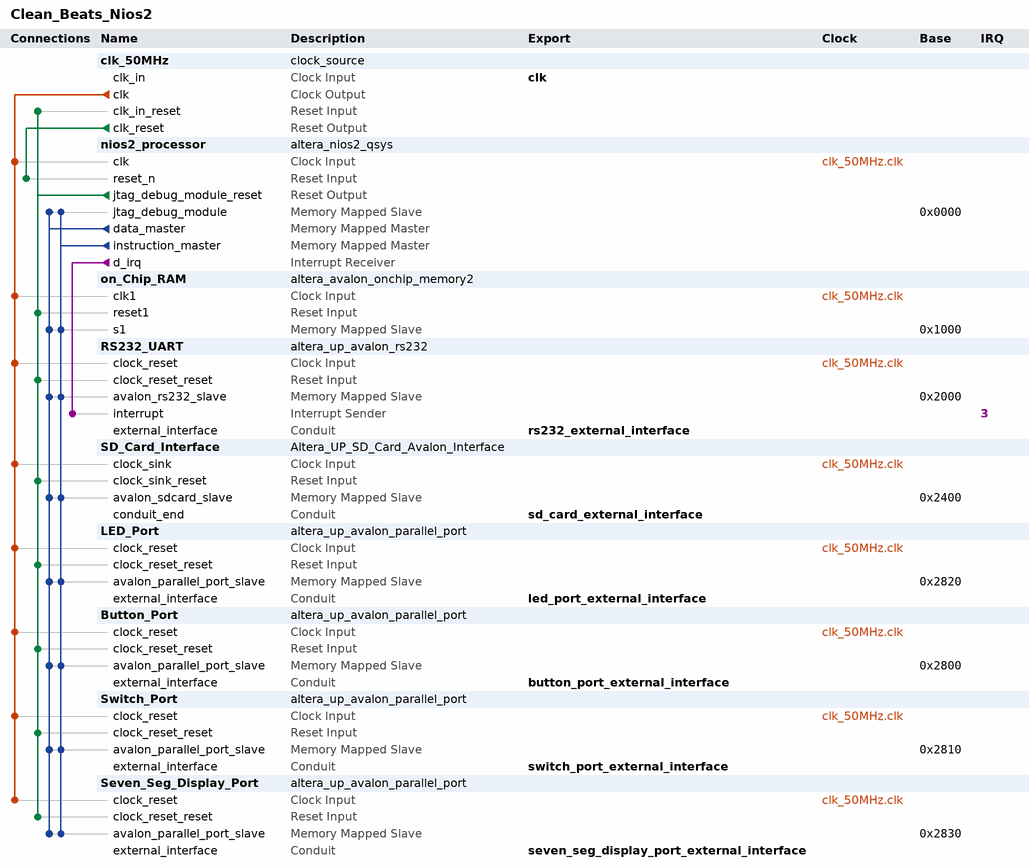
[diagram p0: system contents]
# Platform Designer (Qsys) system Clean_Beats_Nios2, Cyclone III EP3C16F484C6
# Parameters at their usual value, and those the tool derives, are not listed.
package require -exact qsys 12.0
create_system Clean_Beats_Nios2
set_project_property DEVICE_FAMILY {Cyclone III}
set_project_property DEVICE EP3C16F484C6

add_instance clk_50MHz clock_source 12.1
set_instance_parameter_value clk_50MHz clockFrequency 50000000

add_instance nios2_processor altera_nios2_qsys 12.1
set_instance_parameter_value nios2_processor setting_preciseIllegalMemAccessException true
set_instance_parameter_value nios2_processor setting_illegalInstructionsTrap true
set_instance_parameter_value nios2_processor mmu_TLBMissExcOffset 64
set_instance_parameter_value nios2_processor resetSlave on_Chip_RAM.s1
set_instance_parameter_value nios2_processor mmu_TLBMissExcSlave on_Chip_ROM.s1
set_instance_parameter_value nios2_processor exceptionSlave on_Chip_RAM.s1
set_instance_parameter_value nios2_processor breakSlave nios2_processor.jtag_debug_module
set_instance_parameter_value nios2_processor impl Fast
set_instance_parameter_value nios2_processor icache_size 4096

add_instance on_Chip_RAM altera_avalon_onchip_memory2 12.1
set_instance_parameter_value on_Chip_RAM dataWidth 32
set_instance_parameter_value on_Chip_RAM dualPort false
set_instance_parameter_value on_Chip_RAM initMemContent true
set_instance_parameter_value on_Chip_RAM initializationFileName on_Chip_RAM
set_instance_parameter_value on_Chip_RAM memorySize 4096

add_instance RS232_UART altera_up_avalon_rs232 12.0
set_instance_parameter_value RS232_UART baud 9600
set_instance_parameter_value RS232_UART parity None

add_instance SD_Card_Interface Altera_UP_SD_Card_Avalon_Interface 1.0

add_instance LED_Port altera_up_avalon_parallel_port 12.0
set_instance_parameter_value LED_Port board DE0
set_instance_parameter_value LED_Port preset LEDs
set_instance_parameter_value LED_Port capture false
set_instance_parameter_value LED_Port edge Rising
set_instance_parameter_value LED_Port irq false

add_instance Button_Port altera_up_avalon_parallel_port 12.0
set_instance_parameter_value Button_Port board DE0
set_instance_parameter_value Button_Port preset Pushbuttons
set_instance_parameter_value Button_Port capture false
set_instance_parameter_value Button_Port edge Rising
set_instance_parameter_value Button_Port irq false

add_instance Switch_Port altera_up_avalon_parallel_port 12.0
set_instance_parameter_value Switch_Port board DE0
set_instance_parameter_value Switch_Port preset {Slider Switches}
set_instance_parameter_value Switch_Port capture false
set_instance_parameter_value Switch_Port edge Rising
set_instance_parameter_value Switch_Port irq false

add_instance Seven_Seg_Display_Port altera_up_avalon_parallel_port 12.0
set_instance_parameter_value Seven_Seg_Display_Port board DE0
set_instance_parameter_value Seven_Seg_Display_Port preset {Seven Segment Displays}
set_instance_parameter_value Seven_Seg_Display_Port capture false
set_instance_parameter_value Seven_Seg_Display_Port edge Rising
set_instance_parameter_value Seven_Seg_Display_Port irq false

# connections
add_connection clk_50MHz.clk Button_Port.clock_reset clock
add_connection clk_50MHz.clk LED_Port.clock_reset clock
add_connection clk_50MHz.clk nios2_processor.clk clock
add_connection clk_50MHz.clk on_Chip_RAM.clk1 clock
add_connection clk_50MHz.clk RS232_UART.clock_reset clock
add_connection clk_50MHz.clk SD_Card_Interface.clock_sink clock
add_connection clk_50MHz.clk Seven_Seg_Display_Port.clock_reset clock
add_connection clk_50MHz.clk Switch_Port.clock_reset clock
add_connection clk_50MHz.clk_reset nios2_processor.reset_n reset
add_connection nios2_processor.jtag_debug_module_reset Button_Port.clock_reset_reset reset
add_connection nios2_processor.jtag_debug_module_reset clk_50MHz.clk_in_reset reset
add_connection nios2_processor.jtag_debug_module_reset LED_Port.clock_reset_reset reset
add_connection nios2_processor.jtag_debug_module_reset on_Chip_RAM.reset1 reset
add_connection nios2_processor.jtag_debug_module_reset RS232_UART.clock_reset_reset reset
add_connection nios2_processor.jtag_debug_module_reset SD_Card_Interface.clock_sink_reset reset
add_connection nios2_processor.jtag_debug_module_reset Seven_Seg_Display_Port.clock_reset_reset reset
add_connection nios2_processor.jtag_debug_module_reset Switch_Port.clock_reset_reset reset
add_connection nios2_processor.data_master Button_Port.avalon_parallel_port_slave avalon
set_connection_parameter_value nios2_processor.data_master/Button_Port.avalon_parallel_port_slave baseAddress 0x2800
add_connection nios2_processor.data_master LED_Port.avalon_parallel_port_slave avalon
set_connection_parameter_value nios2_processor.data_master/LED_Port.avalon_parallel_port_slave baseAddress 0x2820
add_connection nios2_processor.data_master nios2_processor.jtag_debug_module avalon
set_connection_parameter_value nios2_processor.data_master/nios2_processor.jtag_debug_module baseAddress 0x0000
add_connection nios2_processor.data_master on_Chip_RAM.s1 avalon
set_connection_parameter_value nios2_processor.data_master/on_Chip_RAM.s1 baseAddress 0x1000
add_connection nios2_processor.data_master RS232_UART.avalon_rs232_slave avalon
set_connection_parameter_value nios2_processor.data_master/RS232_UART.avalon_rs232_slave baseAddress 0x2000
add_connection nios2_processor.data_master SD_Card_Interface.avalon_sdcard_slave avalon
set_connection_parameter_value nios2_processor.data_master/SD_Card_Interface.avalon_sdcard_slave baseAddress 0x2400
add_connection nios2_processor.data_master Seven_Seg_Display_Port.avalon_parallel_port_slave avalon
set_connection_parameter_value nios2_processor.data_master/Seven_Seg_Display_Port.avalon_parallel_port_slave baseAddress 0x2830
add_connection nios2_processor.data_master Switch_Port.avalon_parallel_port_slave avalon
set_connection_parameter_value nios2_processor.data_master/Switch_Port.avalon_parallel_port_slave baseAddress 0x2810
add_connection nios2_processor.instruction_master Button_Port.avalon_parallel_port_slave avalon
set_connection_parameter_value nios2_processor.instruction_master/Button_Port.avalon_parallel_port_slave baseAddress 0x2800
add_connection nios2_processor.instruction_master LED_Port.avalon_parallel_port_slave avalon
set_connection_parameter_value nios2_processor.instruction_master/LED_Port.avalon_parallel_port_slave baseAddress 0x2820
add_connection nios2_processor.instruction_master nios2_processor.jtag_debug_module avalon
set_connection_parameter_value nios2_processor.instruction_master/nios2_processor.jtag_debug_module baseAddress 0x0000
add_connection nios2_processor.instruction_master on_Chip_RAM.s1 avalon
set_connection_parameter_value nios2_processor.instruction_master/on_Chip_RAM.s1 baseAddress 0x1000
add_connection nios2_processor.instruction_master RS232_UART.avalon_rs232_slave avalon
set_connection_parameter_value nios2_processor.instruction_master/RS232_UART.avalon_rs232_slave baseAddress 0x2000
add_connection nios2_processor.instruction_master SD_Card_Interface.avalon_sdcard_slave avalon
set_connection_parameter_value nios2_processor.instruction_master/SD_Card_Interface.avalon_sdcard_slave baseAddress 0x2400
add_connection nios2_processor.instruction_master Seven_Seg_Display_Port.avalon_parallel_port_slave avalon
set_connection_parameter_value nios2_processor.instruction_master/Seven_Seg_Display_Port.avalon_parallel_port_slave baseAddress 0x2830
add_connection nios2_processor.instruction_master Switch_Port.avalon_parallel_port_slave avalon
set_connection_parameter_value nios2_processor.instruction_master/Switch_Port.avalon_parallel_port_slave baseAddress 0x2810
add_connection nios2_processor.d_irq RS232_UART.interrupt interrupt
set_connection_parameter_value nios2_processor.d_irq/RS232_UART.interrupt irqNumber 3

# exported interfaces
add_interface clk clock sink
set_interface_property clk EXPORT_OF clk_50MHz.clk_in
add_interface rs232_external_interface conduit end
set_interface_property rs232_external_interface EXPORT_OF RS232_UART.external_interface
add_interface sd_card_external_interface conduit end
set_interface_property sd_card_external_interface EXPORT_OF SD_Card_Interface.conduit_end
add_interface led_port_external_interface conduit end
set_interface_property led_port_external_interface EXPORT_OF LED_Port.external_interface
add_interface button_port_external_interface conduit end
set_interface_property button_port_external_interface EXPORT_OF Button_Port.external_interface
add_interface switch_port_external_interface conduit end
set_interface_property switch_port_external_interface EXPORT_OF Switch_Port.external_interface
add_interface seven_seg_display_port_external_interface conduit end
set_interface_property seven_seg_display_port_external_interface EXPORT_OF Seven_Seg_Display_Port.external_interface

save_system Clean_Beats_Nios2.qsys
